# EasyEDA Pro project ProPrj_小中心板_2025-08-09.epro, schematic Schematic1_1

## Sheets
1 P1: Board Name: Board1; Create Date: 2024-12-30; Page Name: P1; Project Name: 云台新滑环; Schematic Name: Schematic1; Update Date: 2024-12-30; Company: 嘉立创EDA; Page Size: A4; Version: V1.0
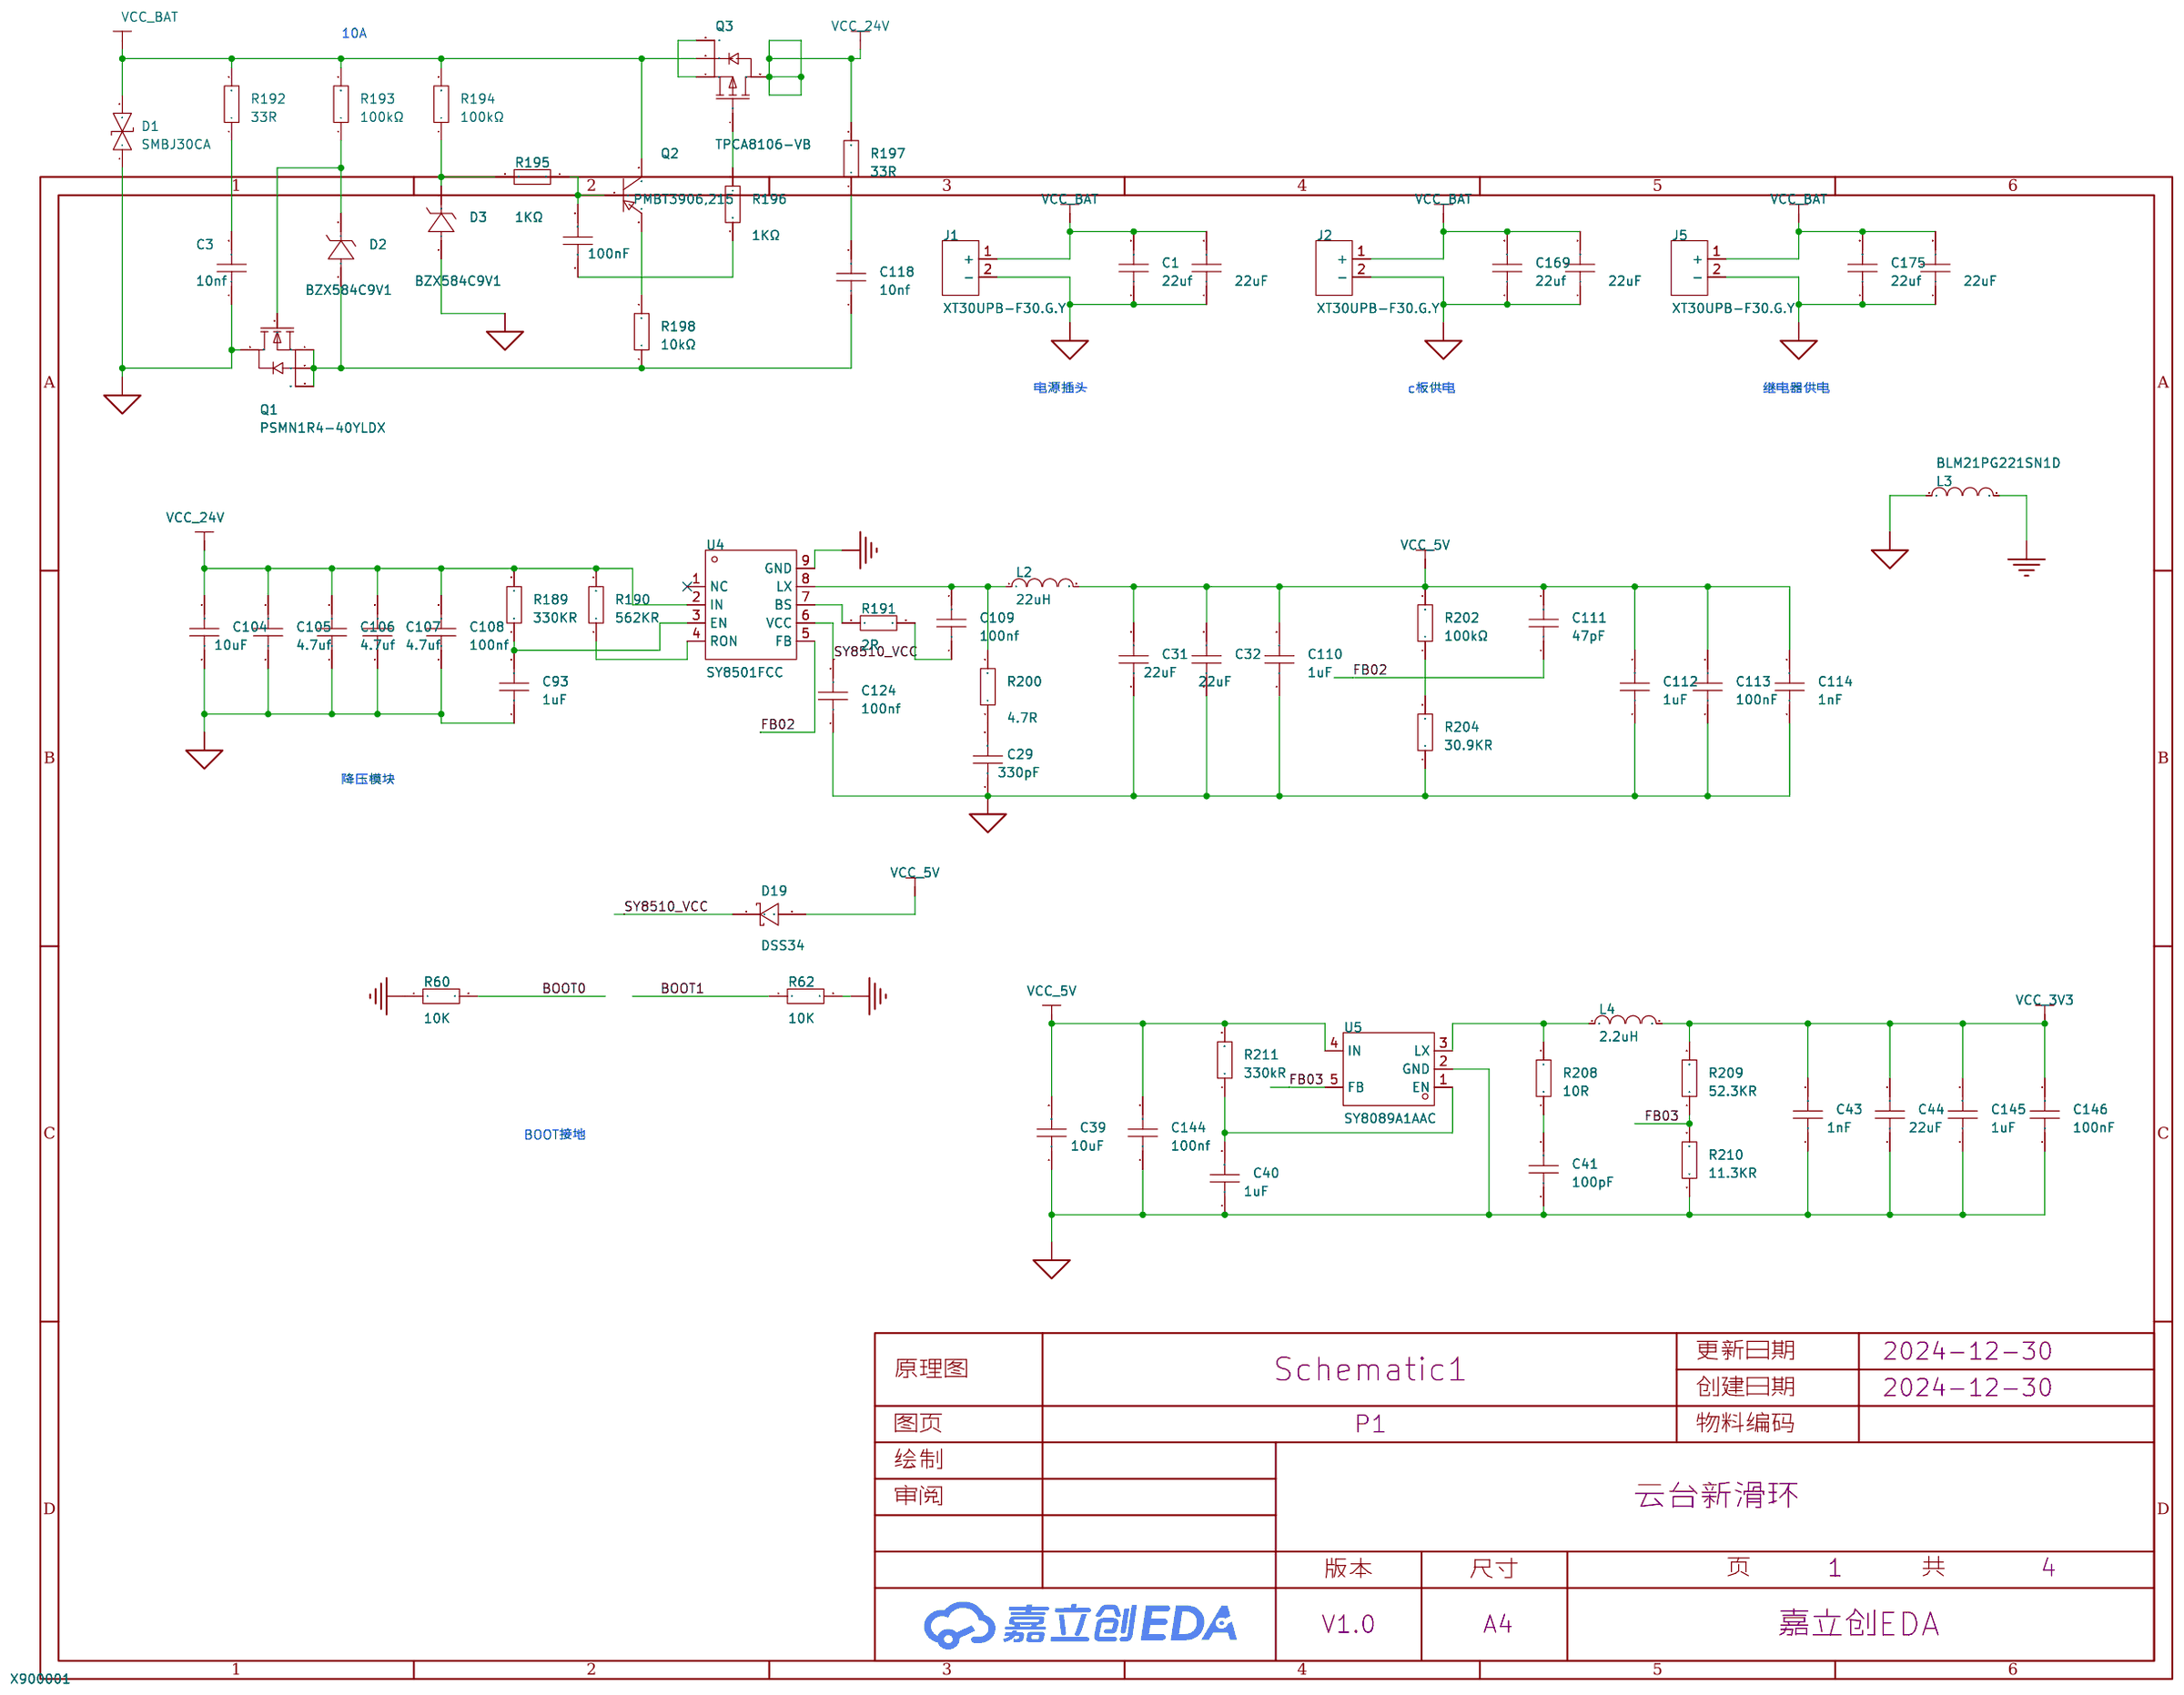
[diagram p0: P1]
2 P2: Page Name: P2
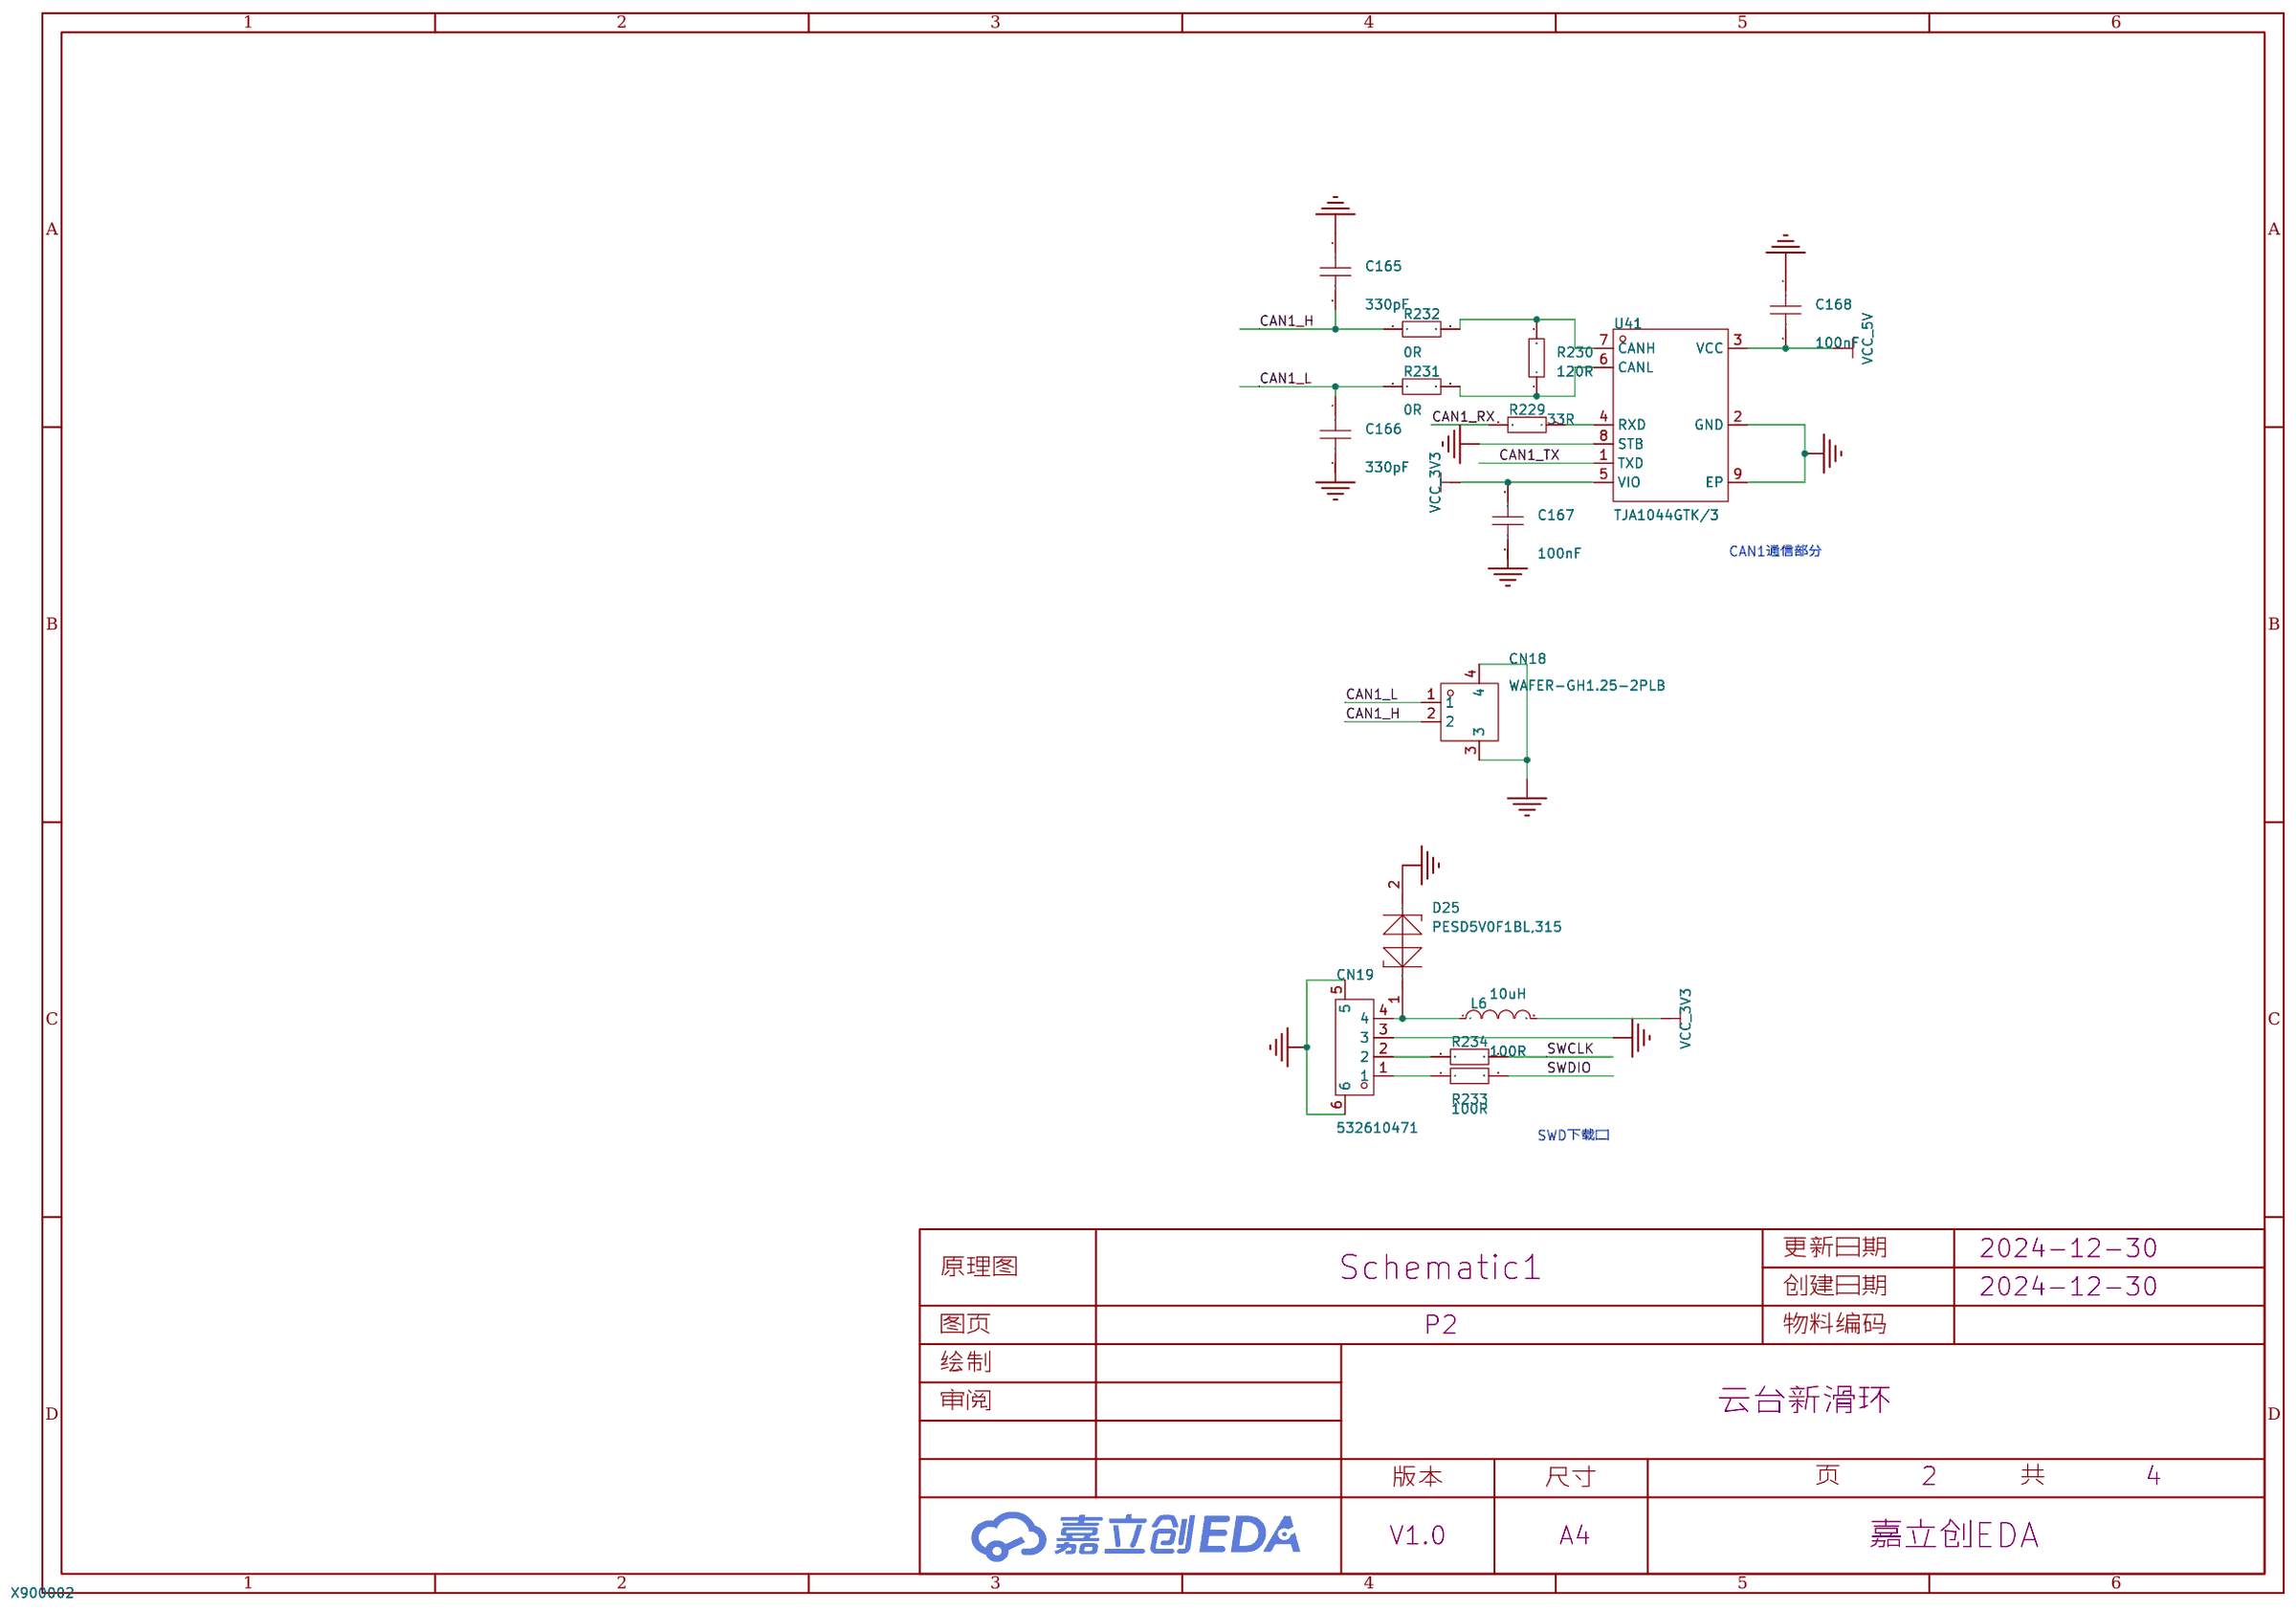
[diagram p1: P2]
3 P3: Page Name: P3
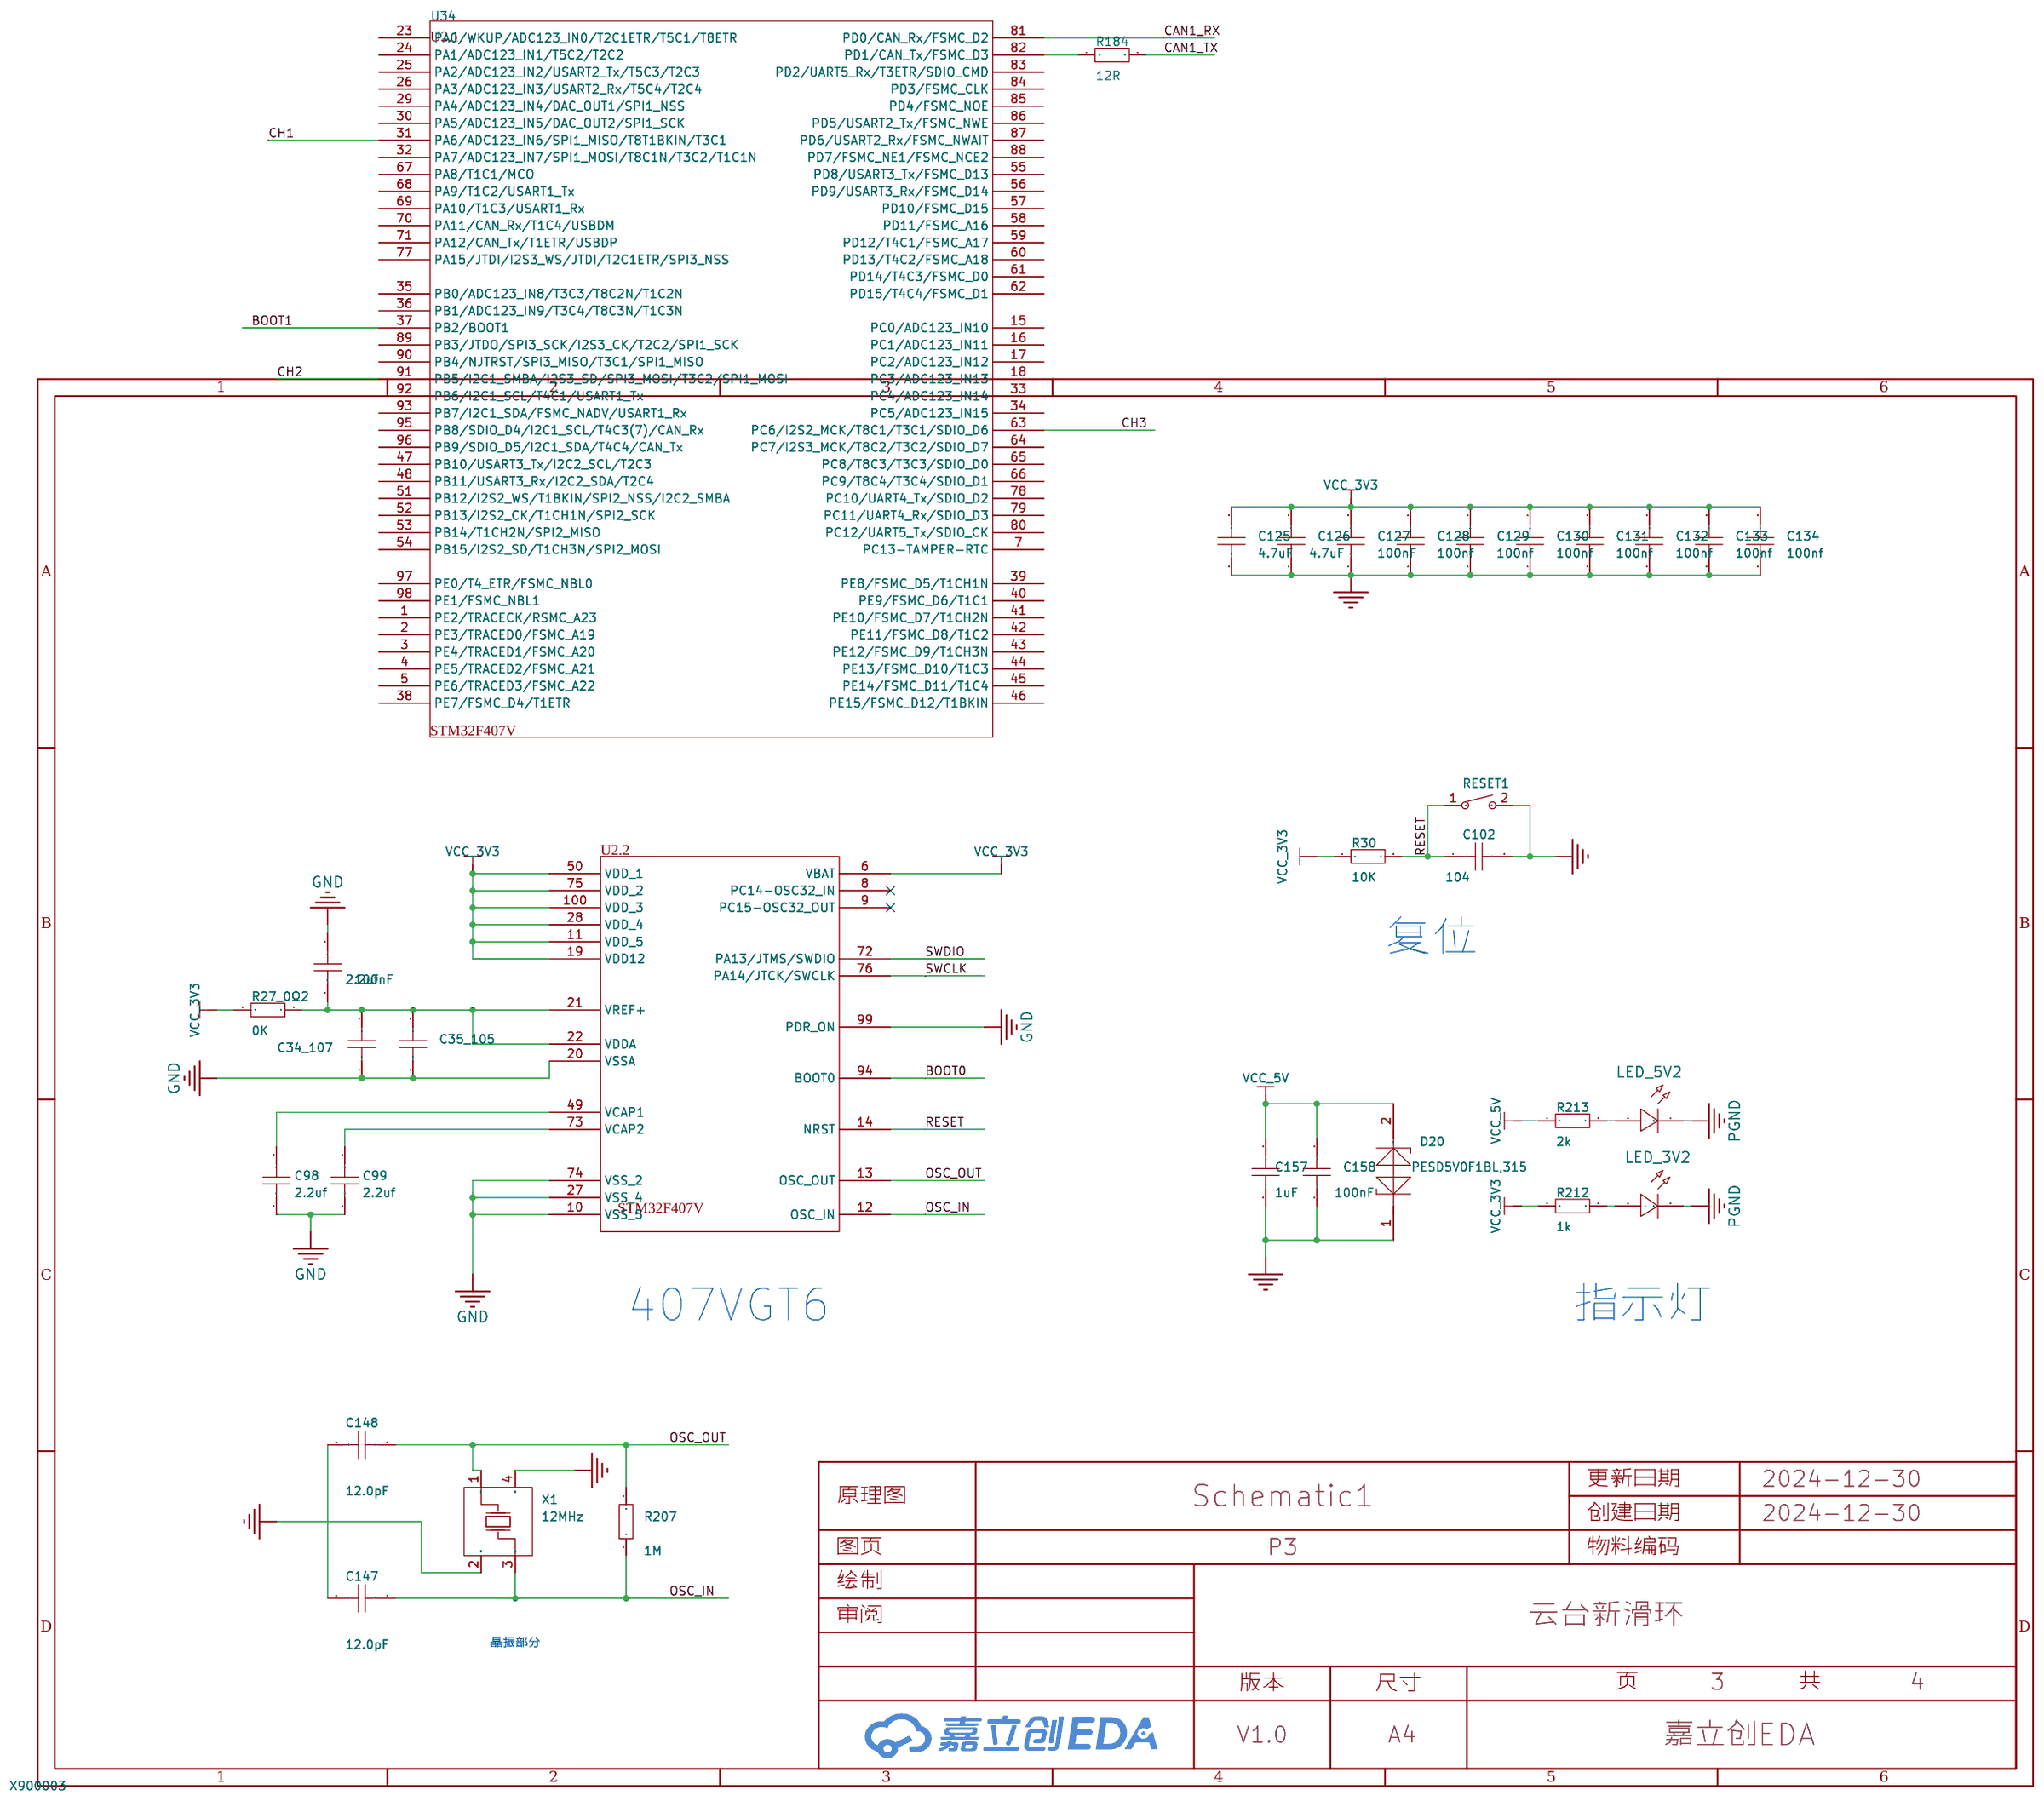
[diagram p2: P3]
4 P4: Page Name: P4
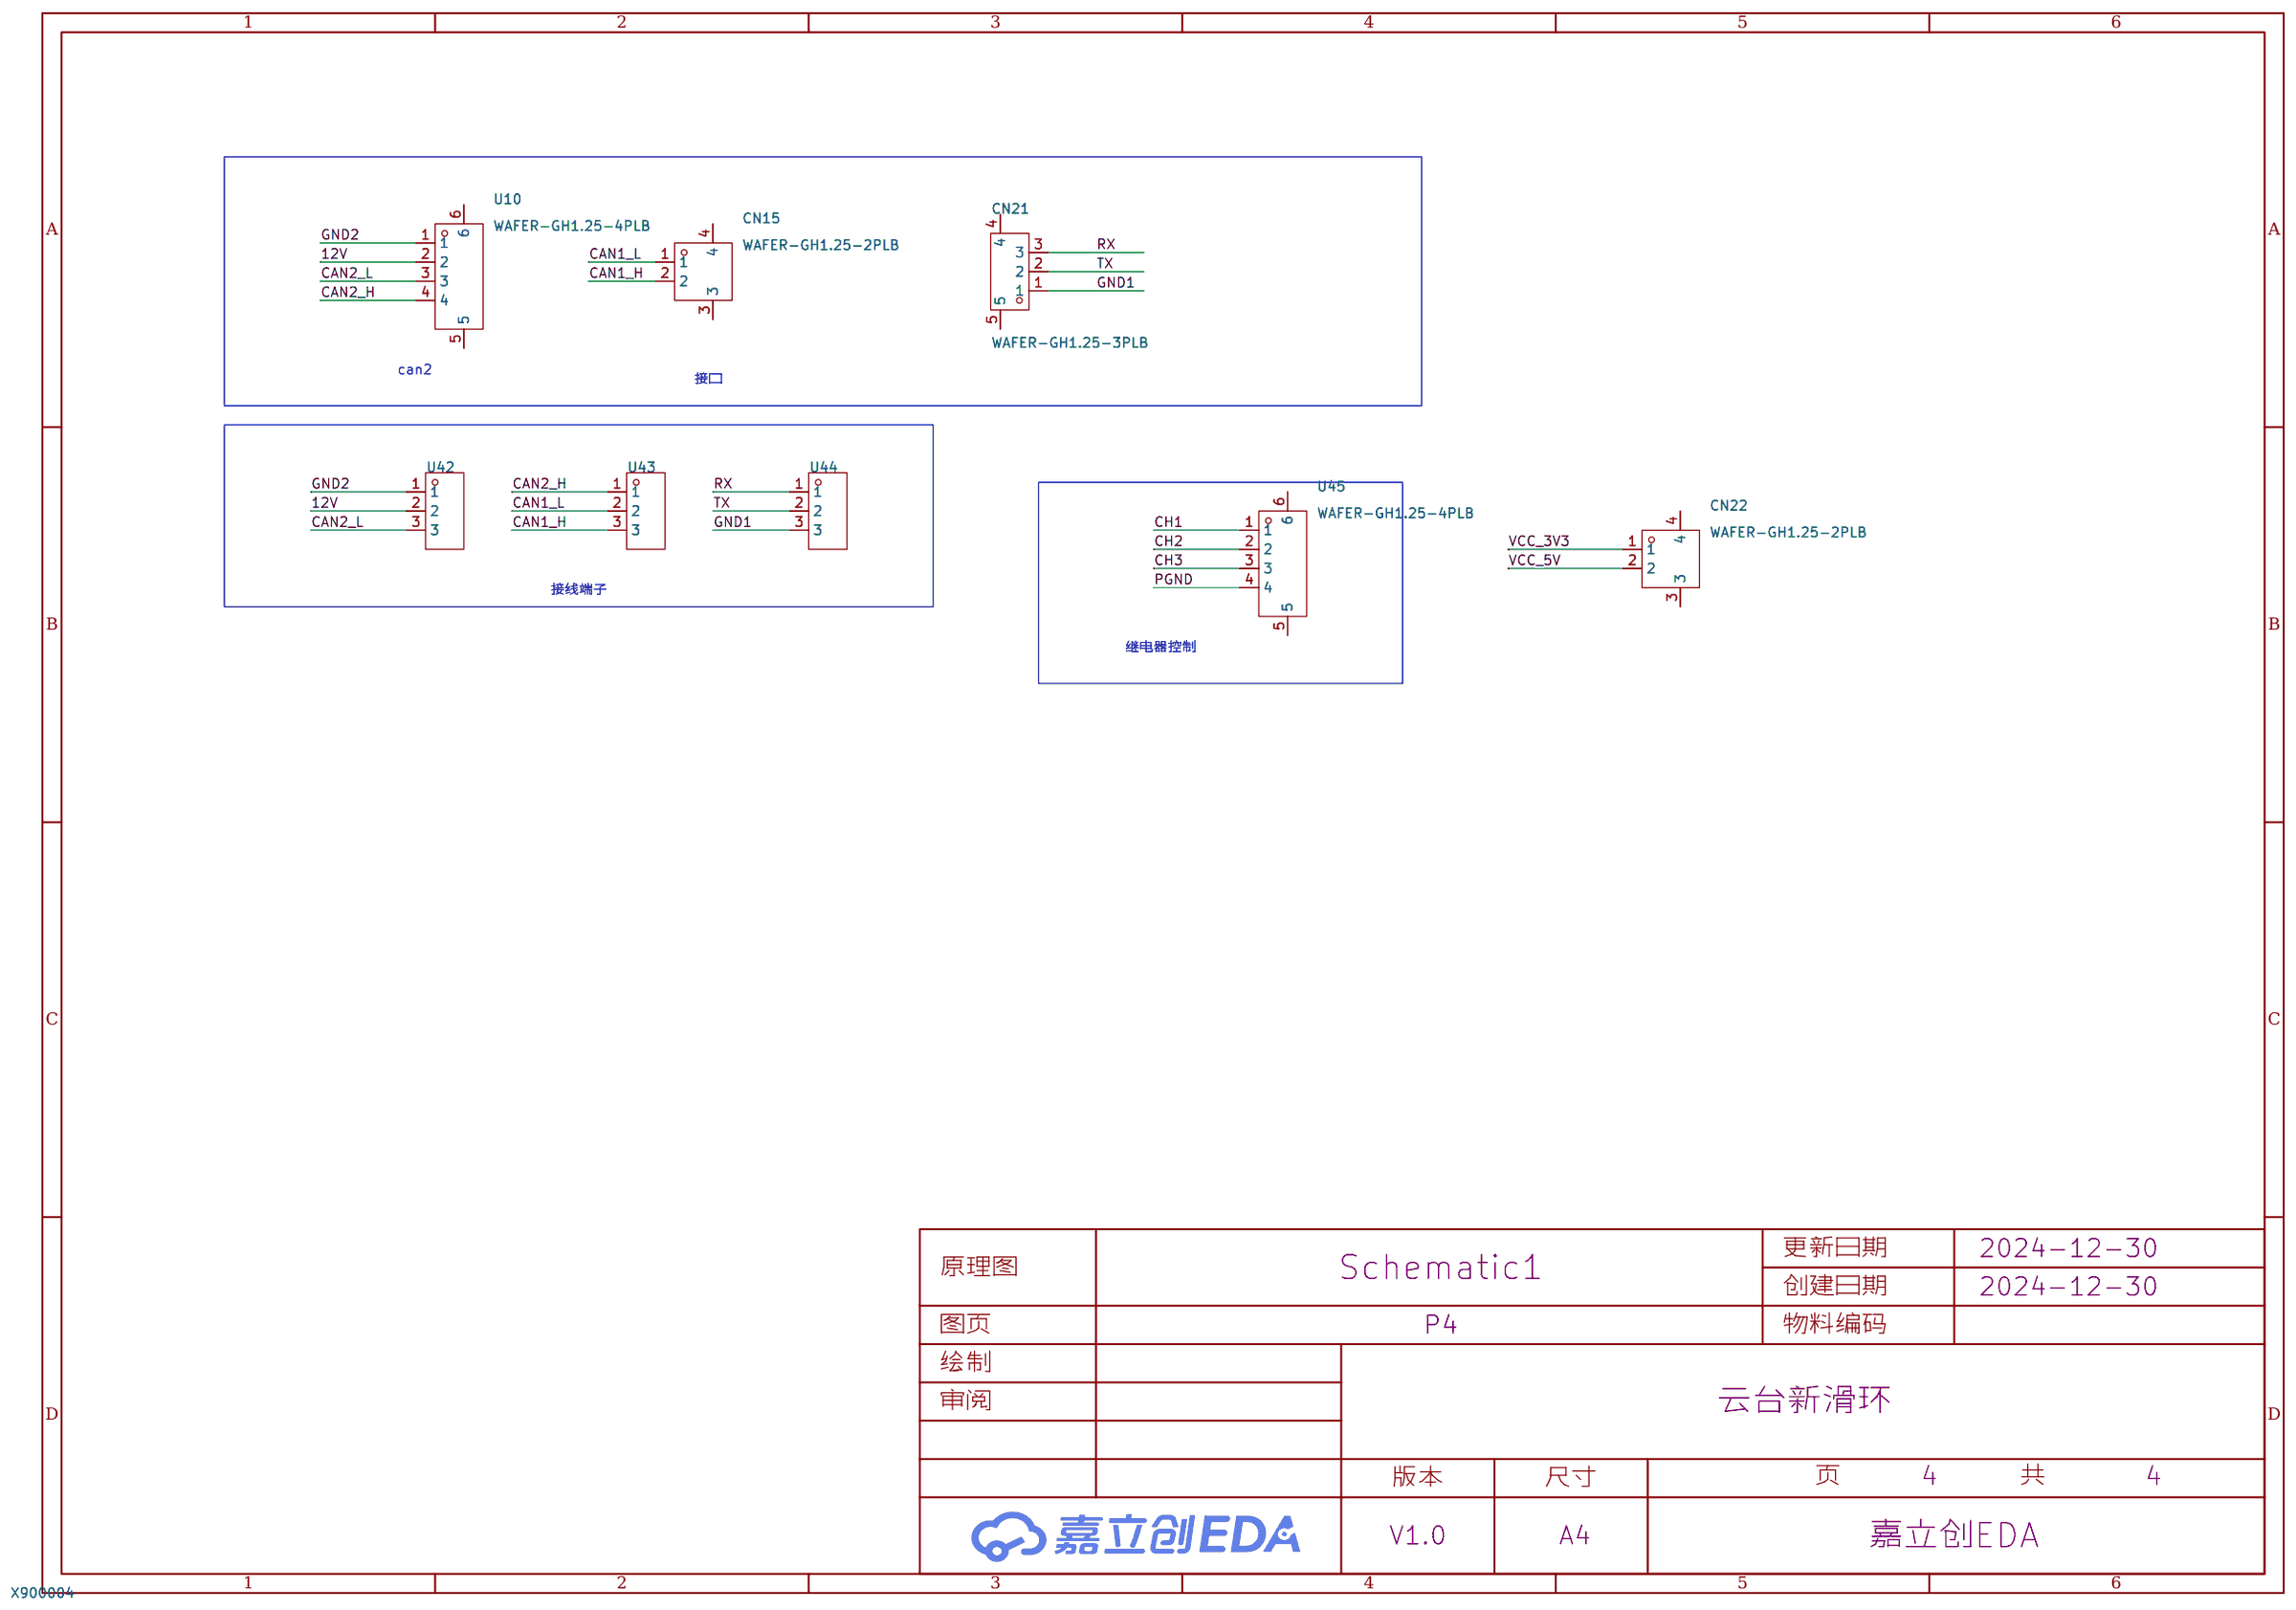
[diagram p3: P4]

## Parts
sheet P1
C1  22uf  [C0603]
C2  100nF  [C0603]
C3  10nf  [C0603]
C4  22uF  [C0603]
C29  330pF  [C0603]
C31  22uF  [C0603]
C32  22uF  [C0603]
C39  10uF  [C0603]
C40  1uF  [C0603]
C41  100pF  [C0603]
C43  1nF  [C0603]
C44  22uF  [C0603]
C93  1uF  [C0603]
C104  10uF  [C0603]
C105  4.7uf  [C0603]
C106  4.7uf  [C0603]
C107  4.7uf  [C0603]
C108  100nf  [C0603]
C109  100nf  [C0603]
C110  1uF  [C0603]
C111  47pF  [C0603]
C112  1uF  [C0603]
C113  100nF  [C0603]
C114  1nF  [C0603]
C118  10nf  [C0603]
C124  100nf  [C0603]
C144  100nf  [C0603]
C145  1uF  [C0603]
C146  100nF  [C0603]
C169  22uf  [C0603]
C170  22uF  [C0603]
C175  22uf  [C0603]
C176  22uF  [C0603]
D1  SMBJ30CA  [SMB_L4.3-W3.6-LS5.4-BI]
D2  BZX584C9V1  [SOD-523_L1.2-W0.8-LS1.6-FD]
D3  BZX584C9V1  [SOD-523_L1.2-W0.8-LS1.6-FD]
D19  DSS34  [SOD-123FL_L2.7-W1.8-LS3.8-RD]
J1  XT30UPB-F30.G.Y  [CONN-TH_XT30UPB-F]
J2  XT30UPB-F30.G.Y  [CONN-TH_XT30UPB-F]
J5  XT30UPB-F30.G.Y  [CONN-TH_XT30UPB-F]
L2  22uH  [L0603]
L3  BLM21PG221SN1D  [L0805]
L4  2.2uH  [L0603]
Q1  PSMN1R4-40YLDX  [SOT-669_L4.9-W4.0-P1.27-LS6.0-BR]
Q2  PMBT3906,215  [SOT-23-3_L2.9-W1.3-P1.90-LS2.4-BR]
Q3  TPCA8106-VB  [DFN-5_L4.9-W5.9-P1.27-LS6.2-BL]
R60  10K  [R0603]
R62  10K  [R0603]
R189  330KR  [R0603]
R190  562KR  [R0603]
R191  2R  [R0603]
R192  33R  [R0603]
R193  100kΩ  [R0603]
R194  100kΩ  [R0603]
R195  1KΩ  [R0603]
R196  1KΩ  [R0603]
R197  33R  [R0603]
R198  10kΩ  [R0603]
R200  4.7R  [R0603]
R202  100kΩ  [R0603]
R204  30.9KR  [R0603]
R208  10R  [R0603]
R209  52.3KR  [R0603]
R210  11.3KR  [R0603]
R211  330kR  [R0603]
U4  SY8501FCC  [SO-8_L4.9-W3.9-P1.27-LS6.0-BL-EP]
U5  SY8089A1AAC  [TSOT-23-5_L2.9-W1.6-P0.95-LS2.8-BR]
sheet P2
C165  330pF  [C0603]
C166  330pF  [C0603]
C167  100nF  [C0603]
C168  100nF  [C0603]
CN18  WAFER-GH1.25-2PLB  [CONN-TH_2P-P1.25_XUNPU_WAFER-GH1.25-2PLB]
CN19  532610471  [CONN-SMD_4P-P1.25_53261-0471]
D25  PESD5V0F1BL,315  [SOD-882_L1.0-W0.6-BI]
L6  10uH  [L0603]
R229  33R  [R0603]
R230  120R  [R0603]
R231  0R  [R0603]
R232  0R  [R0603]
R233  100R  [R0603]
R234  100R  [R0603]
U41  TJA1044GTK/3  [HVSON-8_L3.0-W3.0-P0.65-BL-EP]
sheet P3
2.2uf  100nF  [C0603]
C34_107  106  [C0603]
C35_105  104  [C0603]
C98  2.2uf  [C0805]
C99  2.2uf  [C0805]
C102  104  [c0603]
C125  4.7uF  [C0603]
C126  4.7uF  [C0603]
C127  100nF  [C0603]
C128  100nf  [C0603]
C129  100nf  [C0603]
C130  100nf  [C0603]
C131  100nf  [C0603]
C132  100nf  [C0603]
C133  100nf  [C0603]
C134  100nf  [C0603]
C147  12.0pF  [C0603]
C148  12.0pF  [C0603]
C157  1uF  [C0603]
C158  100nF  [C0603]
D20  PESD5V0F1BL,315  [SOD-882_L1.0-W0.6-BI]
LED_3V2  -  [LED_0603]
LED_5V2  -  [LED_0603]
R27_0Ω2  0K  [R0805]
R30  10K  [R0805]
R184  12R  [R0603]
R207  1M  [R0603]
R212  1k  [R0603]
R213  2k  [R0603]
RESET1  TS-1092S-B3D2-G  [SW-SMD_L6.1-W3.6-LS7.9]
U34  -  [407vgt6]
X1  12MHz  [CRYSTAL-SMD_4P-L3.2-W2.5-BL]
sheet P4
CN15  WAFER-GH1.25-2PLB  [CONN-TH_2P-P1.25_XUNPU_WAFER-GH1.25-2PLB]
CN21  WAFER-GH1.25-3PLB  [CONN-SMD_3P-P1.25_XUNPU_WAFER-GH1.25-3PLB]
CN22  WAFER-GH1.25-2PLB  [CONN-TH_2P-P1.25_XUNPU_WAFER-GH1.25-2PLB]
U10  WAFER-GH1.25-4PLB  [CONN-SMD_4P-P1.25_XUNPU_WAFER-GH1.25-4PLB]
U42  DB125-3.5-3P-GN-S  [CONN-TH_3P-P3.50_L7.4-W10.5]
U43  DB125-3.5-3P-GN-S  [CONN-TH_3P-P3.50_L7.4-W10.5]
U44  DB125-3.5-3P-GN-S  [CONN-TH_3P-P3.50_L7.4-W10.5]
U45  WAFER-GH1.25-4PLB  [CONN-SMD_4P-P1.25_XUNPU_WAFER-GH1.25-4PLB]

## Library data of the parts
2.2uf C1-C4 C29 C31 C32 C34_107 C35_105 C41 C93 C104-C114 C118 C124-C134 C144-C148 C157 C158 C165-C170 C175 C176 = CAP_0603: Supplier Footprint: 0603
C39 C40 C43 C44 = CGA0603X7R104K500JT: 容值:100nF;精度:±10%;额定电压:50V;材质(温度系数):X7R;; LCSC Part Name: 100nF ±10% 50V; Supplier Part: C6119867; Manufacturer: HRE(芯声); Supplier Footprint: 0603; JLCPCB Part Class: Extended Part; Datasheet: https://atta.szlcsc.com/upload/public/pdf/source/20181010/C307423_0E0C4E35F3A09F81C2E5C84E00499E42.pdf; Supplier: LCSC; Tolerance: ±10%; Voltage Rated: 50V; Temperature Coefficient: X7R
D1 = SMBJ30CA_C2925441: 反向截止电压(Vrwm):30V;最大钳位电压:48.4V;峰值脉冲电流(Ipp)@10/1000us:12.4A;峰值脉冲功率(Ppp)@10/1000us:600W;击穿电压:33.3V;; Supplier Part: C2925441; Manufacturer: Liown(里阳半导体); Supplier Footprint: SMB; JLCPCB Part Class: 扩展库; Datasheet: https://atta.szlcsc.com/upload/public/pdf/source/20231227/03AB1CAA057903440EC8583E8018C05E.pdf; Supplier: LCSC; Reverse Stand-Off Voltage (Vrwm): 30V; Maximum Clamping Voltage: 48.4V; Peak Pulse Current (Ipp)@10/1000us: 12.4A; Peak Pulse Power Dissipation (Ppp)@10/1000us: 600W; Breakdown Voltage: 33.3V; Reverse Leakage Current (Ir): 1uA; Type: TVS
D2 D3 = BZX584C9V1_C19077465: 二极管配置:独立式;稳压值(标称值):9.1V;稳压值(范围):8.5V~9.6V;功率(Pd):150mW;; Supplier Part: C19077465; Manufacturer: 宏迦橙; Supplier Footprint: SOD-523; JLCPCB Part Class: 扩展库; Datasheet: https://atta.szlcsc.com/upload/public/pdf/source/20240403/17C82979B7F938C6B80AC7FEE4722071.pdf; Supplier: LCSC; Diode Configuration: 独立式; Zener Voltage (Nom): 9.1V; Reverse Leakage Current (Ir): 500nA@6V; Zener Voltage (Range): 8.5V~9.6V; Power Dissipation: 150mW; Zener Impedance (Zzt): 15Ω
D19 = DSS34_C511866: 正向压降(Vf):550mV@3A;直流反向耐压(Vr):40V;平均整流电流(Io):3A;; LCSC Part Name: 电压:40V 电流:3A; Supplier Part: C511866; Manufacturer: BORN(伯恩半导体); Supplier Footprint: SOD-123FL; JLCPCB Part Class: 扩展库; Datasheet: https://atta.szlcsc.com/upload/public/pdf/source/20231213/A35D7F17905BC063B6E854915CEDE7F7.pdf; Supplier: LCSC; Forward Voltage (Vf@If): 550mV@3A; Reverse Voltage (Vr): 40V; Average Rectified Current (Io): 3A
J1 J2 J5 = XT30UPB-F30.G.Y: 类别:-;类型1:-;; LCSC Part Name: AMASS(艾迈斯)直立焊板式连接器XT30UPB30-F.G.*; Supplier Part: C108769; Manufacturer: AMASS(艾迈斯); JLCPCB Part Class: 扩展库; Datasheet: https://atta.szlcsc.com/upload/public/pdf/source/20220715/AFD68B9E8B6CA95A7295DBF4AF9325E4.pdf; Supplier: LCSC; Brand: 艾迈斯; Type: 航模插头; Colour: 黄色; RatedVoltage: DC 500V; InterfaceType: 母头; MetalMaterial: 镀金; InsulationMaterial: PA; RatedCurrent: 15A; contact resistance: 0.65mΩ
L2 L4 L6 = L_0603
L3 = BLM21PG221SN1D: 标称阻抗@测试频率:220Ω@100MHz;误差:±25%;直流电阻(RDC):45mΩ;; LCSC Part Name: 单路 0805磁珠 阻抗220Ω@100MHz; Supplier Part: C85840; Manufacturer: muRata(村田); Supplier Footprint: 0805; JLCPCB Part Class: 扩展库; Datasheet: https://atta.szlcsc.com/upload/public/pdf/source/20180326/C118443_3FAC30E9A4F0E6B81275543C61E0685E.pdf; Supplier: LCSC; Impedance @ Frequency: 220Ω@100MHz; Tolerance: ±25%; DC Resistance: 45mΩ; Current Rating: 2A; Circuits: 1
Q1 = PSMN1R4-40YLDX: 类型:1个N沟道;漏源电压(Vdss):40V;连续漏极电流(Id):100A;功率(Pd):238W;导通电阻(RDS(on)@Vgs,Id):1.4mΩ@10V,25A;阈值电压(Vgs(th)@Id):2.2V@1mA;; LCSC Part Name: 1个N沟道 耐压:40V 电流:100A; Supplier Part: C458253; Manufacturer: Nexperia(安世); Supplier Footprint: SOT-669; JLCPCB Part Class: 扩展库; Datasheet: https://atta.szlcsc.com/upload/public/pdf/source/20191121/C458253_E2C9D3DA08B9360ECF3070255ECBA475.pdf; Supplier: LCSC; Type: 1个N沟道; Drain Source Voltage (Vdss): 40V; Continuous Drain Current (Id): 100A; Power Dissipation (Pd): 238W; Drain Source On Resistance (RDS(on)@Vgs,Id): 1.4mΩ@10V,25A; Gate Threshold Voltage (Vgs(th)@Id): 2.2V@1mA; Total Gate Charge (Qg@Vgs): 96nC@10V; Input Capacitance (Ciss@Vds): 6.661nF@20V; Operating Temperature: -55℃~+175℃@(Tj)
Q2 = PMBT3906,215: 晶体管类型:PNP;集电极电流(Ic):200mA;集射极击穿电压(Vceo):40V;功率(Pd):250mW;直流电流增益(hFE@Ic,Vce):100@10mA,1V;; LCSC Part Name: PNP 电流:200mA 耐压:40V; Supplier Part: C8670; Manufacturer: Nexperia(安世); Supplier Footprint: SOT-23; JLCPCB Part Class: 扩展库; Datasheet: https://atta.szlcsc.com/upload/public/pdf/source/20130412/1457706600965.pdf; Supplier: LCSC; Transistor Type: PNP; Collector Current (Ic): 200mA; Collector-Emitter Breakdown Voltage (Vceo): 40V; Power Dissipation (Pd): 250mW; DC Current Gain (hFE@Ic,Vce): 100@10mA,1V; Transition Frequency (fT): 250MHz; Collector Cut-Off Current (Icbo): 50nA; Collector-Emitter Saturation Voltage (VCE(sat)@Ic,Ib): 400mV@50mA,5mA
Q3 = TPCA8106-VB: 类型:1个P沟道;漏源电压(Vdss):30V;连续漏极电流(Id):-;导通电阻(RDS(on)@Vgs,Id):-;; LCSC Part Name: 1个P沟道 耐压:30V; Supplier Part: C19188180; Manufacturer: VBsemi(微碧半导体); Supplier Footprint: QFN-8(5x6); JLCPCB Part Class: 扩展库; Datasheet: https://atta.szlcsc.com/upload/public/pdf/source/20231103/6B97B1909106D762E88B0D035EB29D33.pdf; Supplier: LCSC; Type: 1个P沟道; Drain Source Voltage (Vdss): 30V
R60 R62 R184 R207 R212 R213 R229-R234 = Res_0603: Supplier Footprint: 0603
R189 R190 R192-R198 R202 R204 R208-R211 = 0603WAF1002T5E: 电阻类型:厚膜电阻;阻值:10kΩ;精度:±1%;功率:100mW;最大工作电压:75V;温度系数:±100ppm/℃;; LCSC Part Name: 厚膜电阻 10kΩ ±1% 100mW; Supplier Part: C25804; Manufacturer: UNI-ROYAL(厚声); Supplier Footprint: 0603; JLCPCB Part Class: Basic Part; Datasheet: https://atta.szlcsc.com/upload/public/pdf/source/20200306/C422600_1E6D84923E4A46A82E41ADD87F860B5C.pdf; Supplier: LCSC; Type: 厚膜电阻; Tolerance: ±1%; Power(Watts): 100mW; Overload Voltage (Max): 75V; Temperature Coefficient: ±100ppm/℃; Operating Temperature Range: -55℃~+155℃
R191 R200 = 0603WAF1002T5E: 电阻类型:厚膜电阻;阻值:10kΩ;精度:±1%;功率:100mW;最大工作电压:75V;温度系数:±100ppm/℃;; LCSC Part Name: 厚膜电阻 10kΩ ±1% 100mW; Supplier Part: C25804; Manufacturer: UNI-ROYAL(厚声); Supplier Footprint: 0603; JLCPCB Part Class: Basic Part; Datasheet: https://atta.szlcsc.com/upload/public/pdf/source/20200306/C422600_1E6D84923E4A46A82E41ADD87F860B5C.pdf; Supplier: LCSC; Type: 厚膜电阻; Tolerance: ±1%; Power(Watts): 100mW; Overload Voltage (Max): 75V; Temperature Coefficient: ±100ppm/℃; Operating Temperature Range: -55℃~+155℃; Voltage Rated: 6.3V
U4 = SY8501FCC: Supplier Part: C365714; Manufacturer: silergy(矽力杰); Supplier Footprint: SO-8-EP; JLCPCB Part Class: 扩展库; Datasheet: https://atta.szlcsc.com/upload/public/pdf/source/20190322/C365714_219A6278F83EB450AA6BA842D4F40851.pdf; Supplier: LCSC
U5 = SY8089A1AAC: Supplier Part: C479074; Manufacturer: silergy(矽力杰); Supplier Footprint: SOT-23-5; JLCPCB Part Class: 扩展库; Datasheet: https://atta.szlcsc.com/upload/public/pdf/source/20200117/C479074_09E605B8BDE11DB5A08573B7E6429A0D.pdf; Supplier: LCSC
CN15 CN18 CN22 = WAFER-GH1.25-2PLB: 插针结构:1x2P;间距:1.25mm;安装方式:立贴;参考系列:GH;总PIN数:2P;排数:1;每排PIN数:2;额定电流:1A;工作温度范围:-25℃~+85℃;; LCSC Part Name: 1x2P 间距:1.25mm 立贴 系列:GH; Supplier Part: C3029368; Manufacturer: XUNPU(讯普); Supplier Footprint: SMD,P=1.25mm; JLCPCB Part Class: 扩展库; Datasheet: https://atta.szlcsc.com/upload/public/pdf/source/20220527/44F824AAC8C2B617205E15955FF9C23D.pdf; Supplier: LCSC; Pins Structure: 1x2P; Pitch: 1.25mm; Mounting Style: 立贴; Reference Series: GH; Number of Pins: 2P; Number of Rows: 1; Number of PINs Per Row: 2; Current Rating (Max): 1A; Operating Temperature Range: -25℃~+85℃
CN19 = 532610471_C696092: 插针结构:1x4P;间距:1.25mm;安装方式:卧贴;参考系列:PicoBlade(MX 1.25);总PIN数:4P;排数:1;每排PIN数:4;行距:-;额定电流:1A;触头材质:磷青铜;触头镀层:锡;工作温度范围:-40℃~+105℃;; LCSC Part Name: 1x4P 间距:1.25mm 卧贴 系列:PicoBlade(MX 1.25); Supplier Part: C696092; Manufacturer: MOLEX; Supplier Footprint: SMD,P=1.25mm; JLCPCB Part Class: 扩展库; Datasheet: https://www.molex.com/content/dam/molex/molex-dot-com/products/automated/en-us/salesdrawingpdf/532/53261/532610471_sd.pdf?inline; Supplier: LCSC; Pins Structure: 1x4P; Pitch: 1.25mm; Mounting Style: 卧贴; Reference Series: PicoBlade(MX 1.25); Number of Pins: 4P; Number of Rows: 1; Number of PINs Per Row: 4; Current Rating (Max): 1A; Contact Material: 磷青铜; Contact Plating: 锡; Operating Temperature Range: -40℃~+105℃; Rated Voltage (Max): 125V; Plastic Material: 玻纤增强PA; Flame Retardant Rating: UL94V-0; Supplementary Features: 辅助焊脚; Colour: 白色; Z-Height of the Board: 3.4mm; X-Length of Bottom Edge on Board (Spacing Line): 10.15mm; Y-Width of Bottom Edge on Board: 5.2mm
D20 D25 = PESD5V0F1BL,315: 极性:双向;反向截止电压(Vrwm):5.5V;最大钳位电压:15V;峰值脉冲电流(Ipp)@10/1000us:2.5A;峰值脉冲功率(Ppp)@10/1000us:-;击穿电压:6V;; LCSC Part Name: 双向ESD; Supplier Part: C45961; Manufacturer: Nexperia(安世); Supplier Footprint: DFN1006-2; JLCPCB Part Class: 扩展库; Datasheet: https://atta.szlcsc.com/upload/public/pdf/source/20150407/1457707275769.pdf; Supplier: LCSC; polarity: 双向; Reverse Stand-Off Voltage (Vrwm): 5.5V; Maximum Clamping Voltage: 15V; Peak Pulse Current (Ipp)@10/1000us: 2.5A; Breakdown Voltage: 6V; Operating Temperature: -40℃~+125℃@(Ta); Type: ESD
U41 = TJA1044GTK/3: Supplier Part: C39690555; Manufacturer: NXP(恩智浦); Supplier: LCSC
C98 C99 C102 = NM0805B104K251CEDN: 容值:100nF;精度:±10%;额定电压:250V;材质(温度系数):X7R;; LCSC Part Name: 100nF ±10% 250V; Supplier Part: C710458; Manufacturer: HUI JU(汇聚); Supplier Footprint: 0805; JLCPCB Part Class: Extended Part; Datasheet: https://atta.szlcsc.com/upload/public/pdf/source/20200723/C710455_046227FB6CFB70D5FCFD5EA84016BC5E.pdf; Supplier: LCSC; Tolerance: ±10%; Voltage Rated: 250V; Temperature Coefficient: X7R
LED_3V2 LED_5V2 = LED_0603-R: Supplier Footprint: 0603
R27_0Ω2 R30 = Res_0805: Supplier Footprint: 0805
RESET1 = TS-1092S-B3D2-G: 电路结构:单刀单掷;安装方式:立贴;作用力:250gf@±30gf;机械寿命:-;带支架:否;; LCSC Part Name: 6.1*3.6*2.5mm 立贴 轻触开关; Supplier Part: C520860; Manufacturer: Yuandi(元迪); Supplier Footprint: SMD; Datasheet: https://atta.szlcsc.com/upload/public/pdf/source/20200424/C520860_DA5AE47D9A9DC527FC720B5FF0895739.pdf; Supplier: LCSC; Circuit: 单刀单掷; Mounting Style: 立贴; Actuator Style: 矩形按钮; Actuator/Cap Color: 灰色; Operating Force: 250gf@±30gf; Pin Style: 鸥翼型; Switch Length: 6.1mm; Switch Width: 3.6mm; Switch Height: 2.5mm; Strike Gundam: 否
U34 = 407vgt6
X1 = X322512MSB4SI: 晶振类型:贴片晶振;频率:12MHz;常温频差:±10ppm;外接负载电容:20pF;频率稳定度(全温):±20ppm;; LCSC Part Name: 12MHz ±10ppm 20pF; Supplier Part: C9002; Manufacturer: YXC(扬兴晶振); Supplier Footprint: SMD3225-4P; JLCPCB Part Class: 基础库; Datasheet: https://atta.szlcsc.com/upload/public/pdf/source/20240329/19D5F850207469550BEB00D7DFEDBC7A.pdf; Supplier: LCSC; Crystal Type: 贴片晶振; Normal temperature Frequency Tolerance: ±10ppm; External load capacitor: 20pF; Frequency Stability(Full temperature range): ±20ppm; Operating Temperature: -40℃~+85℃
CN21 = WAFER-GH1.25-3PLB: 插针结构:1x3P;间距:1.25mm;安装方式:立贴;参考系列:GH;总PIN数:3P;排数:1;每排PIN数:3;额定电流:1A;工作温度范围:-25℃~+85℃;; LCSC Part Name: 1x3P 间距:1.25mm 立贴 系列:GH; Supplier Part: C3029369; Manufacturer: XUNPU(讯普); Supplier Footprint: SMD,P=1.25mm; JLCPCB Part Class: 扩展库; Datasheet: https://atta.szlcsc.com/upload/public/pdf/source/20220527/44F824AAC8C2B617205E15955FF9C23D.pdf; Supplier: LCSC; Pins Structure: 1x3P; Pitch: 1.25mm; Mounting Style: 立贴; Reference Series: GH; Number of Pins: 3P; Number of Rows: 1; Number of PINs Per Row: 3; Current Rating (Max): 1A; Operating Temperature Range: -25℃~+85℃
U10 U45 = WAFER-GH1.25-4PLB: 插针结构:1x4P;间距:1.25mm;安装方式:立贴;参考系列:GH;总PIN数:4P;排数:1;每排PIN数:4;额定电流:1A;工作温度范围:-25℃~+85℃;; LCSC Part Name: 1x4P 间距:1.25mm 立贴 系列:GH; Supplier Part: C3029370; Manufacturer: XUNPU(讯普); Supplier Footprint: SMD,P=1.25mm; JLCPCB Part Class: 扩展库; Datasheet: https://atta.szlcsc.com/upload/public/pdf/source/20220527/44F824AAC8C2B617205E15955FF9C23D.pdf; Supplier: LCSC; Pins Structure: 1x4P; Pitch: 1.25mm; Mounting Style: 立贴; Reference Series: GH; Number of Pins: 4P; Number of Rows: 1; Number of PINs Per Row: 4; Current Rating (Max): 1A; Operating Temperature Range: -25℃~+85℃
U42-U44 = DB125-3.5-3P-GN-S: 结构:1x3P;间距:3.5mm;颜色:绿色;安装方式:直插;额定电流:13.5A;额定电压:250V;排数:1;线规 - AWG:16~28;线规 - 平方毫米:1;每排PIN数:3;工作温度范围:-40℃~+105℃;; LCSC Part Name: 3.5mm 1x3P 排数:1 每排P数:3 直插; Supplier Part: C466971; Manufacturer: DORABO(地博电气); Supplier Footprint: 插件,P=3.5mm; JLCPCB Part Class: 扩展库; Datasheet: https://atta.szlcsc.com/upload/public/pdf/source/20221227/3B943AA1CFCAE24F1BA4E72404938A89.pdf; Supplier: LCSC; Structure: 1x3P; Pitch: 3.5mm; Color: 绿色; Mounting Style: 直插; Current Rating (Max): 13.5A; Voltage Rating (Max): 250V; Number of Pins: 3P; Number of Rows: 1; Wire Gauge - AWG: 16~28; Wire Gauge - mm2: 1; Number of PINs Per Row: 3; Operating Temperature Range: -40℃~+105℃

## Nets
12V: U10.2 U42.2
GND: 2.2uf.1 C34_107.2 C35_105.2 C98.2 C99.2 C102.2 C125.1 C126.1 C127.1 C128.1 C129.1 C130.1 C131.1 C132.1 C133.1 C134.1 C147.2 C148.2 C157.1 C158.1 C165.1 C166.2 C167.2 C168.1 CN18.3 CN18.4 CN19.3 CN19.5 CN19.6 D20.1 D25.2 L3.2 R60.1 R62.2 RESET1.2 U4.9(GND) U34.10(VSS_5) U34.20(VSSA) U34.27(VSS_4) U34.74(VSS_2) U34.99(PDR_ON) U41.2(GND) U41.8(STB) U41.9(EP) X1.2(GND) X1.4(GND)
GND1: CN21.1 U44.3
GND2: U10.1 U42.1
PGND: C1.1 C3.1 C4.1 C29.1 C31.1 C32.1 C39.1 C40.1 C41.1 C43.1 C44.1 C93.1 C104.1 C105.1 C106.1 C107.1 C108.1 C110.1 C112.1 C113.1 C114.1 C124.1 C144.1 C145.1 C146.1 C169.1 C170.1 C175.1 C176.1 D1.1 D3.1(A) J1.2(-) J2.2(-) J5.2(-) L3.1 LED_3V2.1(C) LED_5V2.1(C) Q1.5(D) R204.1 R210.1 U5.2(GND) U45.4
VCC_3V3: C43.2 C44.2 C125.2 C126.2 C127.2 C128.2 C129.2 C130.2 C131.2 C132.2 C133.2 C134.2 C145.2 C146.2 C167.1 CN22.1 L4.2 L6.2 R27_0Ω2.1 R30.1 R209.2 R212.1 U34.6(VBAT) U34.11(VDD_5) U34.19(VDD12) U34.28(VDD_4) U34.50(VDD_1) U34.75(VDD_2) U34.100(VDD_3) U41.5(VIO)
VCC_5V: C31.2 C32.2 C39.2 C110.2 C111.2 C112.2 C113.2 C114.2 C144.2 C157.2 C158.2 C168.2 CN22.2 D19.2 D20.2 L2.2 R202.2 R211.2 R213.1 U5.4(IN) U41.3(VCC)
VCC_24V: C104.2 C105.2 C106.2 C107.2 C108.2 Q3.5(D) R189.2 R190.2 R197.2 U4.2(IN)
VCC_BAT: C1.2 C4.2 C169.2 C170.2 C175.2 C176.2 D1.2 J1.1(+) J2.1(+) J5.1(+) Q2.3(C) Q3.1(S) Q3.2(S) Q3.3(S) R192.2 R193.2 R194.2
BOOT0: R60.2 U34.94(BOOT0)
BOOT1: R62.1 U34.37(PB2/BOOT1)
CAN1_H: C165.2 CN15.2 CN18.2 R232.1 U43.3
CAN1_L: C166.1 CN15.1 CN18.1 R231.1 U43.2
CAN1_RX: R229.2 U34.81(PD0/CAN_Rx/FSMC_D2)
CAN1_TX: R184.2 U41.1(TXD)
CAN2_H: U10.4 U43.1
CAN2_L: U10.3 U42.3
CH1: U34.31(PA6/ADC123_IN6/SPI1_MISO/T8T1BKIN/T3C1) U45.1
CH2: U34.91(PB5/I2C1_SMBA/I2S3_SD/SPI3_MOSI/T3C2/SPI1_MOSI) U45.2
CH3: U34.63(PC6/I2S2_MCK/T8C1/T3C1/SDIO_D6) U45.3
FB02: C111.1 R202.1 R204.2 U4.5(FB)
FB03: R209.1 R210.2 U5.5(FB)
OSC_IN: C147.1 R207.1 U34.12(OSC_IN) X1.3(OSC2)
OSC_OUT: C148.1 R207.2 U34.13(OSC_OUT) X1.1(OSC1)
RESET: C102.1 R30.2 RESET1.1 U34.14(NRST)
RX: CN21.3 U44.1
SWCLK: R234.2 U34.76(PA14/JTCK/SWCLK)
SWDIO: R233.2 U34.72(PA13/JTMS/SWDIO)
SY8510_VCC: C124.2 D19.1 U4.6(VCC)
TX: CN21.2 U44.2
$1N3075: C3.2 R192.1
$1N3077: D3.2(K) R194.1 R195.2
$1N3078: C2.2 Q2.1(B) R195.1
$1N3080: D2.2(K) Q1.4(G) R193.1
$1N3082: C2.1 Q2.2(E) R196.2 R198.2
$1N3083: Q3.4(G) R196.1
$1N3084: C118.2 R197.1
$1N3085: C118.1 D2.1(A) Q1.1(S) Q1.2(S) Q1.3(S) R198.1
$1N3107: C93.2 R189.1 U4.3(EN)
$1N3108: R190.1 U4.4(RON)
$1N3109: R191.1 U4.7(BS)
$1N3112: C109.1 R191.2
$1N3113: C109.2 L2.1 R200.2 U4.8(LX)
$1N3138: C29.2 R200.1
$1N5426: C40.2 R211.1 U5.1(EN)
$1N5427: L4.1 R208.2 U5.3(LX)
$1N5428: C41.2 R208.1
$2N4237: R229.1 U41.4(RXD)
$2N4239: R230.1 R231.2 U41.6(CANL)
$2N4240: R230.2 R232.2 U41.7(CANH)
$2N4258: CN19.1 R233.1
$2N4259: CN19.2 R234.1
$2N4265: CN19.4 D25.1 L6.1
$3N639: C98.1 U34.49(VCAP1)
$3N640: C99.1 U34.73(VCAP2)
$3N650: R184.1 U34.82(PD1/CAN_Tx/FSMC_D3)
$3N662: 2.2uf.2 C34_107.1 C35_105.1 R27_0Ω2.2 U34.21(VREF+) U34.22(VDDA)
$3N2818: LED_5V2.2(A) R213.2
$3N2819: LED_3V2.2(A) R212.2

Not connected (* = marked no-connect by the designer): CN15 3 4; CN21 4 5; CN22 3 4; U4 1(NC)*; U10 5 6; U34 1(PE2/TRACECK/RSMC_A23) 2(PE3/TRACED0/FSMC_A19) 3(PE4/TRACED1/FSMC_A20) 4(PE5/TRACED2/FSMC_A21) 5(PE6/TRACED3/FSMC_A22) 7(PC13-TAMPER-RTC) 8(PC14-OSC32_IN)* 9(PC15-OSC32_OUT)* 15(PC0/ADC123_IN10) 16(PC1/ADC123_IN11) 17(PC2/ADC123_IN12) 18(PC3/ADC123_IN13) 23(PA0/WKUP/ADC123_IN0/T2C1ETR/T5C1/T8ETR) 24(PA1/ADC123_IN1/T5C2/T2C2) 25(PA2/ADC123_IN2/USART2_Tx/T5C3/T2C3) 26(PA3/ADC123_IN3/USART2_Rx/T5C4/T2C4) 29(PA4/ADC123_IN4/DAC_OUT1/SPI1_NSS) 30(PA5/ADC123_IN5/DAC_OUT2/SPI1_SCK) 32(PA7/ADC123_IN7/SPI1_MOSI/T8C1N/T3C2/T1C1N) 33(PC4/ADC123_IN14) 34(PC5/ADC123_IN15) 35(PB0/ADC123_IN8/T3C3/T8C2N/T1C2N) 36(PB1/ADC123_IN9/T3C4/T8C3N/T1C3N) 38(PE7/FSMC_D4/T1ETR) 39(PE8/FSMC_D5/T1CH1N) 40(PE9/FSMC_D6/T1C1) 41(PE10/FSMC_D7/T1CH2N) 42(PE11/FSMC_D8/T1C2) 43(PE12/FSMC_D9/T1CH3N) 44(PE13/FSMC_D10/T1C3) 45(PE14/FSMC_D11/T1C4) 46(PE15/FSMC_D12/T1BKIN) 47(PB10/USART3_Tx/I2C2_SCL/T2C3) 48(PB11/USART3_Rx/I2C2_SDA/T2C4) 51(PB12/I2S2_WS/T1BKIN/SPI2_NSS/I2C2_SMBA) 52(PB13/I2S2_CK/T1CH1N/SPI2_SCK) 53(PB14/T1CH2N/SPI2_MISO) 54(PB15/I2S2_SD/T1CH3N/SPI2_MOSI) 55(PD8/USART3_Tx/FSMC_D13) 56(PD9/USART3_Rx/FSMC_D14) 57(PD10/FSMC_D15) 58(PD11/FSMC_A16) 59(PD12/T4C1/FSMC_A17) 60(PD13/T4C2/FSMC_A18) 61(PD14/T4C3/FSMC_D0) 62(PD15/T4C4/FSMC_D1) 64(PC7/I2S3_MCK/T8C2/T3C2/SDIO_D7) 65(PC8/T8C3/T3C3/SDIO_D0) 66(PC9/T8C4/T3C4/SDIO_D1) 67(PA8/T1C1/MCO) 68(PA9/T1C2/USART1_Tx) 69(PA10/T1C3/USART1_Rx) 70(PA11/CAN_Rx/T1C4/USBDM) 71(PA12/CAN_Tx/T1ETR/USBDP) 77(PA15/JTDI/I2S3_WS/JTDI/T2C1ETR/SPI3_NSS) 78(PC10/UART4_Tx/SDIO_D2) 79(PC11/UART4_Rx/SDIO_D3) 80(PC12/UART5_Tx/SDIO_CK) 83(PD2/UART5_Rx/T3ETR/SDIO_CMD) 84(PD3/FSMC_CLK) 85(PD4/FSMC_NOE) 86(PD5/USART2_Tx/FSMC_NWE) 87(PD6/USART2_Rx/FSMC_NWAIT) 88(PD7/FSMC_NE1/FSMC_NCE2) 89(PB3/JTDO/SPI3_SCK/I2S3_CK/T2C2/SPI1_SCK) 90(PB4/NJTRST/SPI3_MISO/T3C1/SPI1_MISO) 92(PB6/I2C1_SCL/T4C1/USART1_Tx) 93(PB7/I2C1_SDA/FSMC_NADV/USART1_Rx) 95(PB8/SDIO_D4/I2C1_SCL/T4C3(7)/CAN_Rx) 96(PB9/SDIO_D5/I2C1_SDA/T4C4/CAN_Tx) 97(PE0/T4_ETR/FSMC_NBL0) 98(PE1/FSMC_NBL1); U45 5 6

## Notes on the sheets
sheet 1
- 10A
- 电源插头
- c板供电
- 继电器供电
- 降压模块
- BOOT接地
sheet 2
- CAN1通信部分
- SWD下载口
sheet 3
- 复位
- 407VGT6
- 指示灯
- 晶振部分
sheet 4
- can2
- 接口
- 接线端子
- 继电器控制
